# EAGLE design USBchLDOv1.1 (EAGLE 8.6.0)
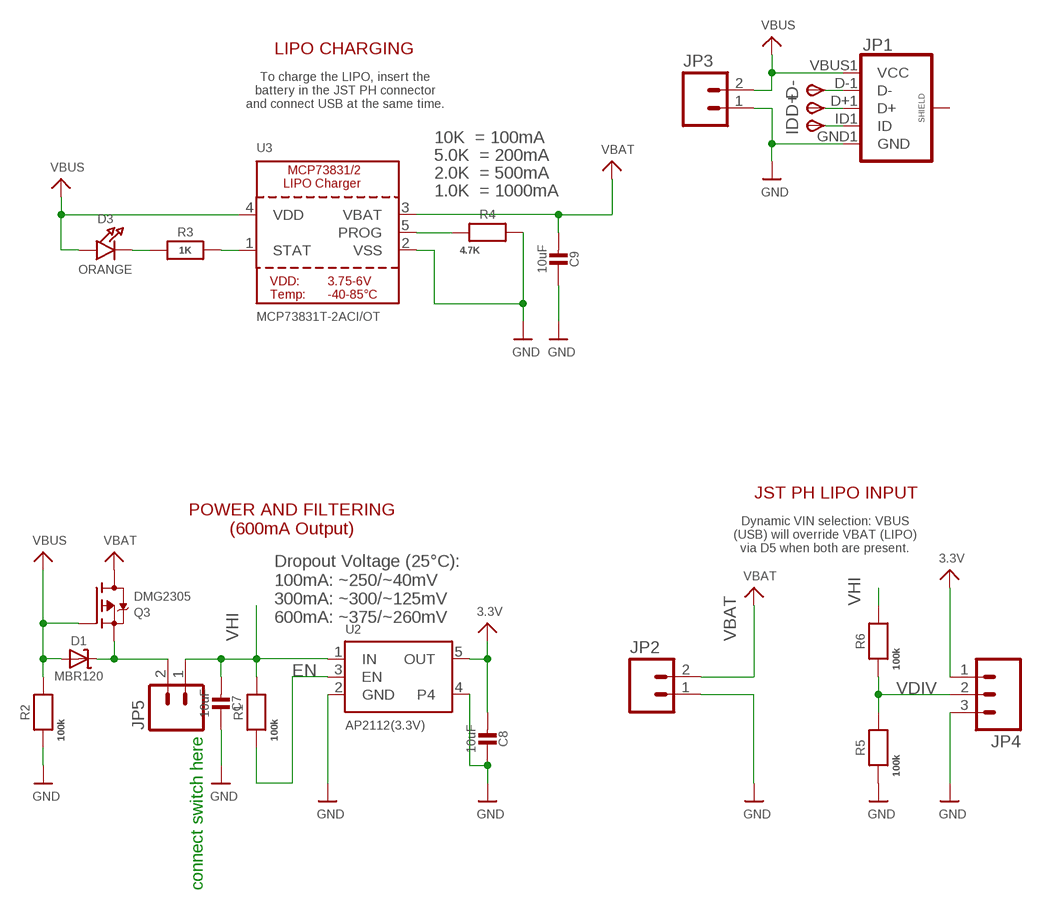
[diagram p0: schematic, sheet 1]

## Parts
C7  10uF  CAP_CERAMIC0805-NOOUTLINE  [0805-NO]
C8  10uF  CAP_CERAMIC0805-NOOUTLINE  [0805-NO]
C9  10uF  CAP_CERAMIC0805-NOOUTLINE  [0805-NO]
D1  MBR120  DIODE-SCHOTTKYSOD-123  [SOD-123]
D3  ORANGE  LED0805_NOOUTLINE  [CHIPLED_0805_NOOUTLINE]
D+  TPSTP09R  [TP09R]
D-  TPSTP09R  [TP09R]
ID  TPSTP09R  [TP09R]
JP1  USB_MICROB_PLUGCONN-11752  [USB-B-MICRO-SMD_V03]
JP2  M02PTH  [1X02]
JP3  M02PTH  [1X02]
JP4  M03PTH  [1X03]
JP5  M02PTH  [1X02]
Q3  DMG2305  MOSFET-P  [SOT23-R]
R1  100k  RESISTOR_0603_NOOUT  [0603-NO]
R2  100k  RESISTOR_0603_NOOUT  [0603-NO]
R3  1K  RESISTOR_0603_NOOUT  [0603-NO]
R4  4.7K  RESISTOR_0603_NOOUT  [0603-NO]
R5  100k  RESISTOR_0603_NOOUT  [0603-NO]
R6  100k  RESISTOR_0603_NOOUT  [0603-NO]
U2  AP2112(3.3V)  VREG_SOT23-5  [SOT23-5]
U3  MCP73831T-2ACI/OT  MCP73831/2  [SOT23-5]

## Nets
3.3V [power]: C8.2 JP4.1 U2.5(OUT)
EN: R1.1 U2.3(EN)
GND: C7.1 C8.1 C9.1 JP1.GND1(GND) JP2.1 JP3.1 JP4.3 R2.1 R4.2 R5.1 U2.2(GND) U2.4 U3.2(VSS)
N$1: D3.C R3.1
N$2: ID.TP(PP) JP1.ID1(ID)
N$3: D+.TP(PP) JP1.D+1(D+)
N$4: D-.TP(PP) JP1.D-1(D-)
N$5 [power]: D1.C JP5.2 Q3.2(S)
N$11: R3.2 U3.1(STAT)
N$12: R4.1 U3.5(PROG)
VBAT [power]: C9.2 JP2.2 Q3.3(D) U3.3(VBAT)
VBUS [power]: D1.A D3.A JP1.VBUS1(VCC) JP3.2 Q3.1(G) R2.2 U3.4(VDD)
VDIV: JP4.2 R5.2 R6.1
VHI [power]: C7.2 JP5.1 R1.2 R6.2 U2.1(IN)
Unconnected: JP1.SHIELD1(SHIELD) JP1.SHIELD2(SHIELD) JP1.SHIELD3(SHIELD)

## Notes on the sheet
- LIPO CHARGING
- To charge the LIPO, insert the
  battery in the JST PH connector
  and connect USB at the same time.
- 10K  = 100mA
- 5.0K  = 200mA
- 2.0K  = 500mA
- 1.0K  = 1000mA
- JST PH LIPO INPUT
- POWER AND FILTERING
  (600mA Output)
- Dynamic VIN selection: VBUS
  (USB) will override VBAT (LIPO)
  via D5 when both are present.
- Dropout Voltage (25°C):
  100mA: ~250/~40mV
  300mA: ~300/~125mV
  600mA: ~375/~260mV
- connect switch here

## Library data of the parts
C7-C9 = microbuilder:CAP_CERAMIC: Ceramic Capacitors For new designs, use the packages preceded by an '_' character since they are more reliable: The following footprints should be used on most boards: _0402 - Standard footprint for regular board layouts _0603 - Standard footprint for regular board layouts _0805 - Standard footprint for regular board layouts _1206 - Standard footprint for regular board layouts For extremely tight-pitch boards where space is at a premium, the following 'micro-pitch' footprints can be used (smaller pads, no silkscreen outline, etc.): _0402MP - Micro-pitch footprint for very dense/compact boards _0603MP - Micro-pitch footprint for very dense/compact boards _0805MP - Micro-pitch footprint for very dense/compact boards _1206MP - Micro-pitch footprint for very dense/compact boards
D1 = microbuilder:DIODE-SCHOTTKY
D3 = microbuilder:LED: LED 0603 - 0603 Surface Mount Package 2mA: Green LED - Low Power (3.9mcd, 2ma, 1.7Vf) - Digikey: 475-2709-2-ND Orange LED - Low Power (9.8mcd, 2ma, 1.8Vf) - Digikey: 475-1194-2-ND Red LED - Low Power (5mcd, 2ma, 1.8Vf) - Digikey: 475-1195-2-ND Yellow LED - Low Power (7mcd, 2ma, 1.8Vf) - Digikey: 475-1196-2-ND 5mA: Blue LED - Low Power (17mcd, 5ma, 2.9Vf) - Digikey: LNJ937W8CRACT-ND 0805 - 0805 Surface Mount Package 2mA: Red LED (8.8mcd, 2mA, 1.8Vf, Clear) - Low Power [Digikey: 475-2510-1-ND] Green LED (5mcd, 2mA, 1.8Vf, Clear) - Low Power [Digikey: 475-2730-1-ND] Yellow LED (11.3mcd, 2mA, 1.8Vf, Clear) - Low Power [Digikey: 475-2555-1-ND] 20mA: Red LED (104mcd, 20mA, Diffused) - LS R976 [Digikey: 475-1278-6-ND] Red LED (12mcd, 20mA, 2.0Vf, Clear) - APT2012EC [Digikey: 754-1128-1-ND] Green LED (15mcd, 20mA, 2.2Vf, Clear) - APT2012GC [Digikey: 754-1131-1-ND] Orange LED (160mcd, 20mA, 2.1Vf, Clear) - APT2012SECK [Digikey: 754-1130-1-ND] 1206 - 1206 Surface Mount Package Green LED (26mcd, 20mA, Diffused) - LG N971 [Digikey: 475-1407-6-ND] Red LED (15mcd, 20mA, Diffused) - LH N974 [Digikey: 475-1416-6-ND] Cree - Cree High-Power Surface Mount LEDs XPEBWT-L1-0000-00D50 - White 111lm 350mA 2.9Vf 6200K 110° XTEAWT-00-0000-00000LEE3 - White 114lm 350mA 2.85Vf 5000K 115° Everlight - Everlight 45-21 Series Surface Mount LEDs 45-21/QK2C-B2832AC2CB2/2T - Warm White 2000mcd 20mA 3.25Vf 3050K 120° 45-21/LK2C-B38452C4CB2/2T - Nuetral White 2000mcd 20mA 3.25Vf 4150K 120° 45-21/LK2C-B50634C6CB2/2T - Cold White 2200mcd 20mA 3.25Vf 5650K 120° PLCC2 Reverse Mount LS T77K-J1L2-1-0-2-R18-Z - Red 11.25mcd 2mA 1.8Vf 630nm 120° LO T77K-L1M2-24-Z - Orange 19.6mcd 2mA 1.8Vf 606nm 120° LY T77K-K2M1-26-Z - Yellow 15.7mcd 2mA 1.8Vf 587nm 120°
D+ D- ID = testpad:TPS: TEST PIN
JP1 = SparkFun-Connectors:USB_MICROB_PLUG: USB Micro-B connectors Some male, some female. Watch your step!; PROD_ID: CONN-11752
JP2 JP3 JP5 = SparkFun-Connectors:M02: Standard 2-pin 0.1" header. Use with - straight break away headers ( PRT-00116) - right angle break away headers (PRT-00553) - swiss pins (PRT-00743) - machine pins (PRT-00117) - female headers (PRT-00115) Molex polarized connector foot print use with: PRT-08233 with associated crimp pins and housings. 2.54_SCREWTERM for use with PRT-10571. 3.5mm Screw Terminal footprints for PRT-08084 5mm Screw Terminal footprints for use with PRT-08432
JP4 = SparkFun-Connectors:M03: Header 3 Standard 3-pin 0.1" header. Use with straight break away headers (SKU : PRT-00116), right angle break away headers (PRT-00553), swiss pins (PRT-00743), machine pins (PRT-00117), and female headers (PRT-00115). Molex polarized connector foot print use with SKU : PRT-08232 with associated crimp pins and housings.
Q3 = microbuilder:MOSFET-P: P-Channel Mosfet LEGEND VDS: Voltage Drain-Source ID: Drain Current RDS(ON): Drain-Source On-State Resistance VGS(TH): Gate-Source Threshold Voltage CISS: Drain-Source Input Capacitance SOT-23 Name VDS ID RDS(ON) VGS(TH) CISS Order Number IRLML5103 30V 760mA 600 mOhm -- 75pF @ 25V Digikey: IRLML5103PBFCT-ND IRLML6401 12V 4.3A 50 mOhm 950mV @ 250µA 830pF @ 10V Digikey: IRLML6401PBFTR-ND NTR0202PL 20V 400mA 800 mOhm 2.3V @ 250uA 70pF @ 5V Digikey: NTR0202PLT1GOSTR-ND NTR4101PT1G 20V 1.8A 85 mOhm 1.2V @ 250uA 675pF @ 10V Digikey: NTR4101PT1GOSCT-ND DMP2004K 20V 600mA 900 mOhm 1V @ 250uA 175pF @ 16V Digikey: DMP2004KDICT-ND PMV65XP 20V 3.9A 76 mOhm 950mV @ 1mA 725pF @ 20V Digikey: 568-2358-2-ND TO-252 Name VDS ID RDS(ON) VGS(TH) CISS Order Number AOD417 30V 25A 34 mOhm 3V @ 250µA 920pF @ 15V Digikey: 785-1106-2-ND PowerPak Name VDS ID RDS(ON) VGS(TH) CISS Order Number AON7401 30V 12A 14 mOhm 3V @ 250µA 2600pF @ 15V Digikey: 785-1302-1-ND
R1-R6 = microbuilder:RESISTOR: Resistors For new designs, use the packages preceded by an '_' character since they are more reliable: The following footprints should be used on most boards: _0402 - Standard footprint for regular board layouts _0603 - Standard footprint for regular board layouts _0805 - Standard footprint for regular board layouts _1206 - Standard footprint for regular board layouts For extremely tight-pitch boards where space is at a premium, the following 'micro-pitch' footprints can be used (smaller pads, no silkscreen outline, etc.): _0402MP - Micro-pitch footprint for very dense/compact boards _0603MP - Micro-pitch footprint for very dense/compact boards _0805MP - Micro-pitch footprint for very dense/compact boards _1206MP - Micro-pitch footprint for very dense/compact boards
U2 = microbuilder:VREG_SOT23-5: SOT23-5 Fixed Voltage Regulators Part Current Out V Out V In V Dropout θJA (°C/W) TJ (°C) Digikey Part No. ADP121 150mA 3.3V 3.4-5.5V 0.09V @ 150mA -- -- ADP121-AUJZ33R7CT-ND ADP121 150mA 3.0V 3.1-5.5V 0.09V @ 150mA -- -- ADP121-AUJZ30R7CT-ND ADP122 300mA 3.3V 3.4-5.5V 0.085V @ 300mA -- -- ADP122AUJZ-3.3-R7CT-ND ADP1712 300mA 3.3V 3.5-5.5V 0.17V @ 300mA -- -- ADP1712AUJZ-3.3-R7TR-ND AP7311 (Low Cost) 150mA 3.3V 3.5-6V 0.15V @ 150mA -- -- AP7311-33WG-7DICT-ND LD39015M18R 150mA 1.8V 1.9V-5.5V 0.08V @ 100mA -- -- 497-6977-1-ND LP2985A-33DBVR 150mA 3.3V 3.3-16V 0.28V @ 150mA 206 150 296-18479-1-ND MCP1824T-3302E/OT 300mA 3.3V 3.5V-6V 0.2V @ 300mA -- -- MCP1824T-3302E/OTCT-ND MIC5205-2.5YM5 TR 150mA 2.5V 2.7-16V 0.165V @ 150mA -- -- 576-1257-2-ND MIC5205-3.0YM5 TR 150mA 3.0V 3.2V-16V 0.165V @ 150mA -- -- 576-1258-2-ND MIC5205-3.3YM5 TR 150mA 3.3V 3.5V-16V 0.165V @ 150mA -- -- 576-1259-2-ND TPS780330220 150mA 3.3V+2.2V 3.6-5.5V 250mV Max -- -- 296-23332-1-ND TDA3663/N1,135 100mA 3.3V 3.5-45V 0.18V @ 50mA -- -- 568-5343-1-ND Max operating temp can be calculated using θJA, TJ (max junction temperature), and power in watts. Set the "Maximum Ambient Temperature" until it reaches TJ ("Max Junction Temperature"), which is the absolute limit for safe use of the regulator: Heat Sink Temperature Calculator <http://www.daycounter.com/Calculators/Heat-Sink-Temperature-Calculator.phtml> For example, With 12V source into a 3.3V LP2985 and a 30mA load, we are dissipating (12V-3.3V) * 0.03A = 0.261W. With a θJA of 206 °C/W, a TJ of 150°C, and 261mW we can safely use the chip without a heat sink up to 75°C (=147.1°C Junction Temperature).
U3 = microbuilder:MCP73831/2: MCP73831/2 LIPO Charger VDD: 3.75 - 6V Temp -40 - 85°C Programmable Charge Rate: 15-500mA NOTE: STAT is a tri-state logic output on the MCP73831 and an open-drain output on the MCP73832. SOT23-5 with 4.2V output and tri-state logic on STAT = MCP73831T-2ACI/OT

## Net classes
1 power: width 0.254 mm

## Board
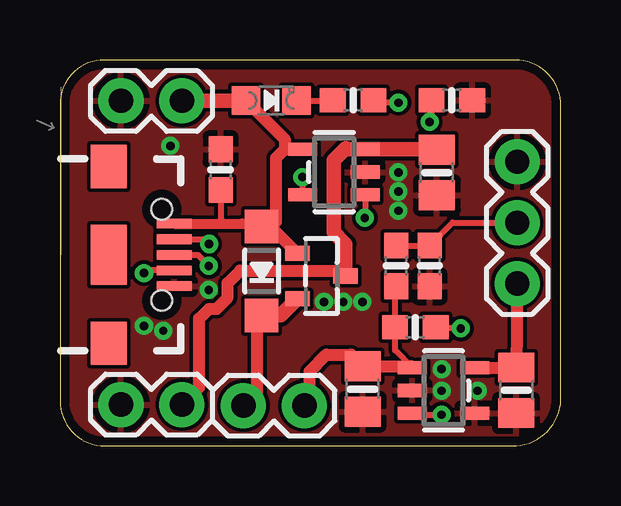
[diagram p1: board, top side]
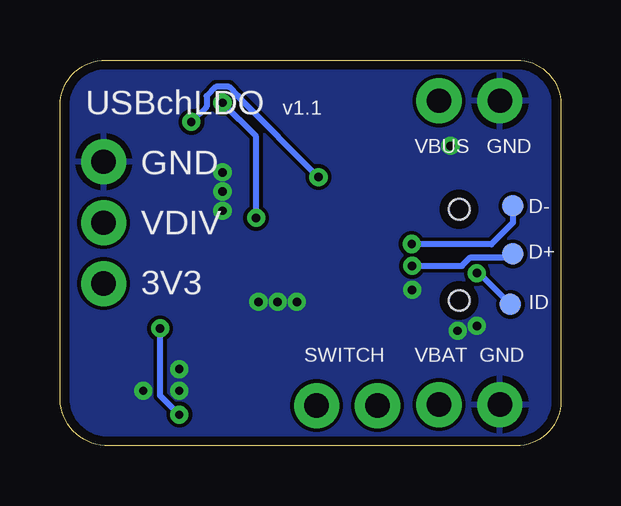
[diagram p2: board, bottom side, seen from below]

Size 20.87 x 16.08 mm. Coordinates in mm from the lower left corner, seen from the top.
Outline: 1.88,0 18.82,0 arc90 20.87,1.94 20.87,14.17 arc90 18.96,16.08 1.84,16.08 arc90 0,14.24 0,1.88 arc90 1.88,0
Copper layers (1*16): Top 0.035mm / dielectric 1.5mm / Bottom 0.035mm
Design rules "default *": minimum track width 6mil, minimum drill 0.35mm, track to track 6mil, track to pad 6mil, pad to pad 6mil, via to via 6mil, smd to smd 6mil, copper to edge 15mil, drill to drill 6mil, minimum pad ring 10mil, minimum via ring 8mil, stop-mask expansion 4mil, vias tented up to drill 20mil, thermal gap 10mil

### Footprints (pad centres in the part's own frame; a part is rotated, then mirrored left to right if it is on the bottom)
0805-NO = smd 1.24 x 1.5: 1 -0.95,0; 2 0.95,0
SOD-123 = smd 1.4 x 1.4: A 1.85,0; C -1.85,0
CHIPLED_0805_NOOUTLINE = smd 1.2 x 1.2: A 0,-1.05; C 0,1.05
TP09R = smd 0.9 x 0.9: TP 0,0
USB-B-MICRO-SMD_V03 = smd 1.45 x 0.4: D+1 2.725,0; D-1 2.725,0.65; GND1 2.725,-1.3; ID1 2.725,-0.65; VBUS1 2.725,1.3 | smd 1.5 x 1.8: SHIELD1 0,3.685; SHIELD2 0,-3.685 | smd 1.5 x 2.5: SHIELD3 0,0 | hole 0.85: 2.2,1.9; 2.2,-1.9
1X02 = drill 1.016 pad 1.88: 1 0,0; 2 2.54,0
1X03 = drill 1.016 pad 1.88: 1 0,0; 2 2.54,0; 3 5.08,0
SOT23-R = smd 0.635 x 1.016: 1 -0.95,-1; 2 0.95,-1; 3 0,1
0603-NO = smd 1.075 x 1: 1 -0.85,0; 2 0.85,0
SOT23-5 = smd 0.55 x 1.2: 1 -0.95,-1.3; 2 0,-1.3; 3 0.95,-1.3; 4 0.95,1.3; 5 -0.95,1.3

### Placement (x,y rotation side)
C7  12.61,2.37 90 top
C8  19.01,2.32 90 top
C9  15.7,11.39 90 top
D1  8.4,7.29 90 top
D3  8.8,14.39 270 top
D+  2,8 0 bottom
D-  2,10 0 bottom
ID  2.1,5.9 0 bottom
JP1  2.04,7.96 0 top
JP2  2.54,1.72 0 top
JP3  2.54,14.38 0 top
JP4  19.05,6.76 90 top
JP5  10.18,1.68 180 top
Q3  10.89,7.08 270 top
R1  14.81,4.95 180 top
R2  6.69,11.51 270 top
R3  12.21,14.4 0 top
R4  16.33,14.4 0 top
R5  15.4,7.5 90 top
R6  14,7.5 270 top
U2  15.98,2.31 270 top
U3  11.42,11.41 90 top

### Tracks (layer width: path | path; a pad name or v marks a point on that pad's centre or on a via)
3.3V
  Top 0.508: U2.5 19.2,3.26 C8.2 19.05,4.38 JP4.1
EN  (via drill 0.35)
  Top 0.254: U2.3 14.74,1.3 v15.9,1.3 | v16.7,4.9 15.71,4.9 R1.1
  Bottom 0.254: v16.7,4.9 16.7,2.1 v15.9,1.3
GND  (via drill 0.35)
  other vias: 14.1,11.4 14.1,10.6 14.1,9.8 11.8,6 11,6 12.6,6 6.2,6.5 3.5,5 17.4,2.3 15.9,3.2 15.9,2.3 4.6,12.5 4.3,4.8
  pour Top: -1.2,18.6 -1.2,-4.3 26.8,-4.3 26.8,19.1 -1.2,19.1
  pour Bottom: -2.5,19.8 -2.5,-5.2 28.5,-5.2 28.5,19.8
N$1
  Top 0.254: D3.C R3.1
N$2  (via drill 0.35)
  Top 0.254: JP1.ID1 3.61,7.31 v3.5,7.2
  Bottom 0.254: ID.TP 3.4,7.2 v3.5,7.2
N$3  (via drill 0.35)
  Top 0.254: JP1.D+1 5.74,7.96 v6.2,7.5
  Bottom 0.254: D+.TP 2.14,7.86 3.77,7.86 4.13,7.5 v6.2,7.5
N$4  (via drill 0.35)
  Top 0.254: JP1.D-1 6.02,8.61 v6.21,8.41
  Bottom 0.254: 2,9.9 1.7,9.9 D-.TP 2,9.3 2.9,8.4 v6.2,8.4 v6.21,8.41
N$5
  Top 0.508: JP5.2 8.21,2.25 8.21,5.43
  Top 0.61: Q3.2 9.2,5.44 D1.C 8.21,5.43
N$11  (via drill 0.35)
  Top 0.254: U3.1 12.72,9.52 v12.7,9.5 | v14.1,14.3 13.26,14.3 R3.2
  Bottom 0.254: v12.7,9.5 12.7,12.9 v14.1,14.3
N$12  (via drill 0.35)
  Top 0.254: U3.5 10.12,11.18 v10.1,11.2 | v15.4,13.5 15.48,13.58 R4.1
  Bottom 0.254: v10.1,11.2 13.44,14.54 13.44,14.57 13.83,14.96 14.37,14.96 14.76,14.57 14.76,14.14 v15.4,13.5
VBAT
  Top 0.508: JP2.2 5.8,2.44 5.8,5.3 6.21,5.71 6.53,5.71 6.99,6.17 6.99,6.79 7.5,7.3 11.67,7.3 Q3.3
  Top 0.61: Q3.3 11.89,8.41 11.4,8.9 11.4,11.9 11.9,12.4 11.94,12.36 U3.3 15.08,12.36 C9.2
VBUS
  Top 0.254: R2.2 6.69,9.37 6.8,9.26 | D1.A 8.78,9.14 9,9.36
  Top 0.406: JP1.VBUS1 6.8,9.26 7.58,9.26 D1.A
  Top 0.508: 9.36,12.36 U3.4 | 9,9.36 9,12 9.36,12.36 | D3.A 9.36,12.78 9.36,12.36 | 8.78,9.14 Q3.1
  Top 0.61: D3.A JP3.2
VDIV
  Top 0.254: R6.1 R5.2 16.35,9.3 JP4.2
VHI
  Top 0.254: U2.1 13.96,3.98 R1.2 13.96,6.61 R6.2
  Top 0.508: U2.1 14.62,3.32 C7.2 12.13,3.8 11.1,3.8 10.4,3.1 10.4,1.9 JP5.1

### Text on the board
bPlace: v1.1 | USBchLDO | GND | VBUS | GND | VDIV | 3V3 | GND | VBAT | SWITCH